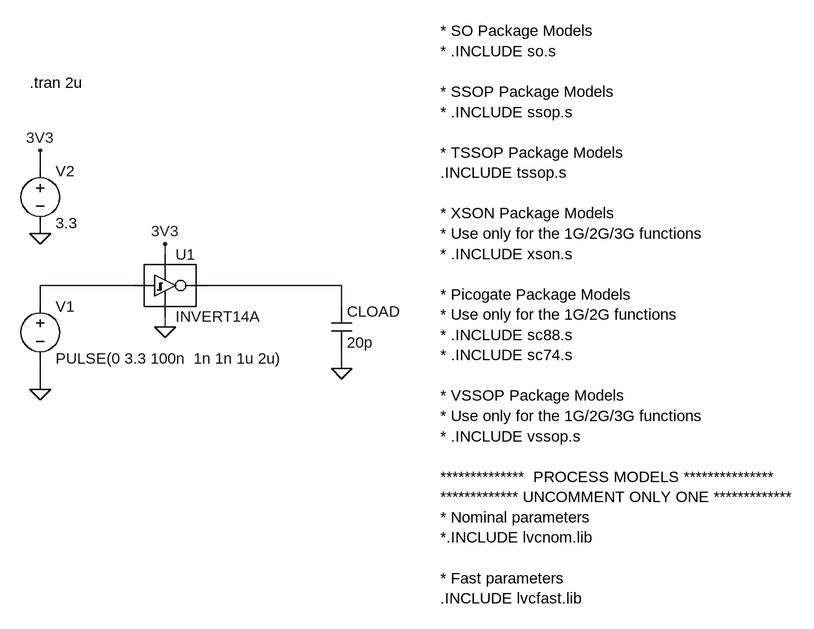
[diagram p0: schematic 74LVC14_Test_Circuit_1.asc]
74LVC14_Test_Circuit_1.asc, the LTspice schematic file:
Version 4
SHEET 1 1236 680
WIRE 0 -48 0 -80
WIRE 0 48 0 32
WIRE 192 80 192 64
WIRE 144 128 0 128
WIRE 464 128 256 128
WIRE 0 160 0 128
WIRE 464 160 464 128
WIRE 192 192 192 176
WIRE 464 256 464 224
WIRE 0 288 0 240
FLAG 0 288 0
FLAG 0 48 0
FLAG 0 -80 3V3
FLAG 192 64 3V3
FLAG 192 192 0
FLAG 464 256 0
SYMBOL voltage 0 144 R0
WINDOW 123 0 0 Left 0
WINDOW 39 0 0 Left 0
SYMATTR InstName V1
SYMATTR Value PULSE(0 3.3 100n  1n 1n 1u 2u)
SYMBOL voltage 0 -64 R0
WINDOW 123 0 0 Left 0
WINDOW 39 0 0 Left 0
SYMATTR InstName V2
SYMATTR Value 3.3
SYMBOL inverter14_philips 192 64 R0
SYMATTR InstName U1
SYMBOL cap 448 160 R0
SYMATTR InstName CLOAD
SYMATTR Value 20p
TEXT -16 -184 Left 0 !.tran 2u
TEXT 616 -264 Left 0 !* SO Package Models\n* .INCLUDE so.s\n \n* SSOP Package Models\n* .INCLUDE ssop.s\n \n* TSSOP Package Models\n.INCLUDE tssop.s \n \n* XSON Package Models\n* Use only for the 1G/2G/3G functions\n* .INCLUDE xson.s\n \n* Picogate Package Models\n* Use only for the 1G/2G functions\n* .INCLUDE sc88.s\n* .INCLUDE sc74.s\n \n* VSSOP Package Models\n* Use only for the 1G/2G/3G functions\n* .INCLUDE vssop.s \n \n**************  PROCESS MODELS *************** \n************* UNCOMMENT ONLY ONE ************* \n* Nominal parameters \n*.INCLUDE lvcnom.lib \n \n* Fast parameters\n.INCLUDE lvcfast.lib

The netlist it stands for:
* 74LVC14_Test_Circuit_1.asc
V1 N001 0 PULSE(0 3.3 100n  1n 1n 1u 2u)
V2 3V3 0 3.3
XU1 N001 N002 3V3 0 INVERT14A  ; pins A Y VCC VSS
CLOAD N002 0 20p
.tran 2u
* SO Package Models
* .INCLUDE so.s
* SSOP Package Models
* .INCLUDE ssop.s
* TSSOP Package Models
.INCLUDE tssop.s
* XSON Package Models
* Use only for the 1G/2G/3G functions
* .INCLUDE xson.s
* Picogate Package Models
* Use only for the 1G/2G functions
* .INCLUDE sc88.s
* .INCLUDE sc74.s
* VSSOP Package Models
* Use only for the 1G/2G/3G functions
* .INCLUDE vssop.s
**************  PROCESS MODELS ***************
************* UNCOMMENT ONLY ONE *************
* Nominal parameters
*.INCLUDE lvcnom.lib
* Fast parameters
.INCLUDE lvcfast.lib
.backanno
.end